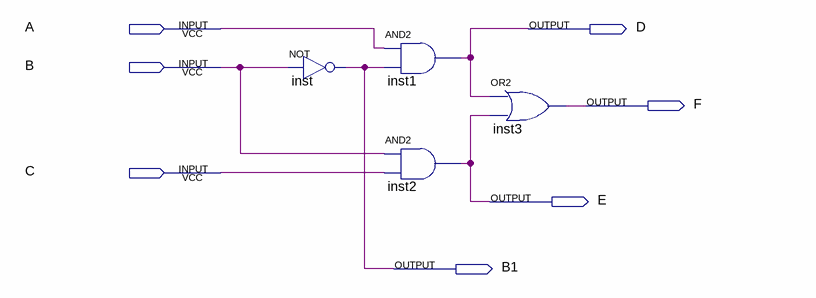
[diagram p0: schematic sheet]
// Quartus schematic Hazard.bdf as structural Verilog: 4 symbols, 7 pins
module Hazard (
  input  A,
  input  B,
  input  C,
  output D,
  output F,
  output E,
  output B1
);

  not inst (B1, B);
  and inst1 (D, A, B1);
  and inst2 (E, B, C);
  or inst3 (F, D, E);
endmodule
